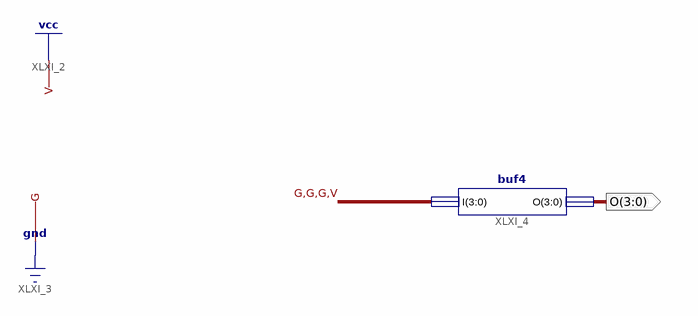
[diagram p0: schematic sheet 1]
// Xilinx ISE schematic constant1fourbit.sch (spartan3adsp) as structural Verilog: 1 symbols, 1 ports
module constant1fourbit (
  output [3:0] O
);

  buf4 XLXI_4 (.I(4'b0001), .O(O));
endmodule
